# EAGLE schematic board (EAGLE 9.5.2)
CNAME: ATMEGA328P Dev Board; CREVISION: 0.1.0

## Sheet 1 of 3
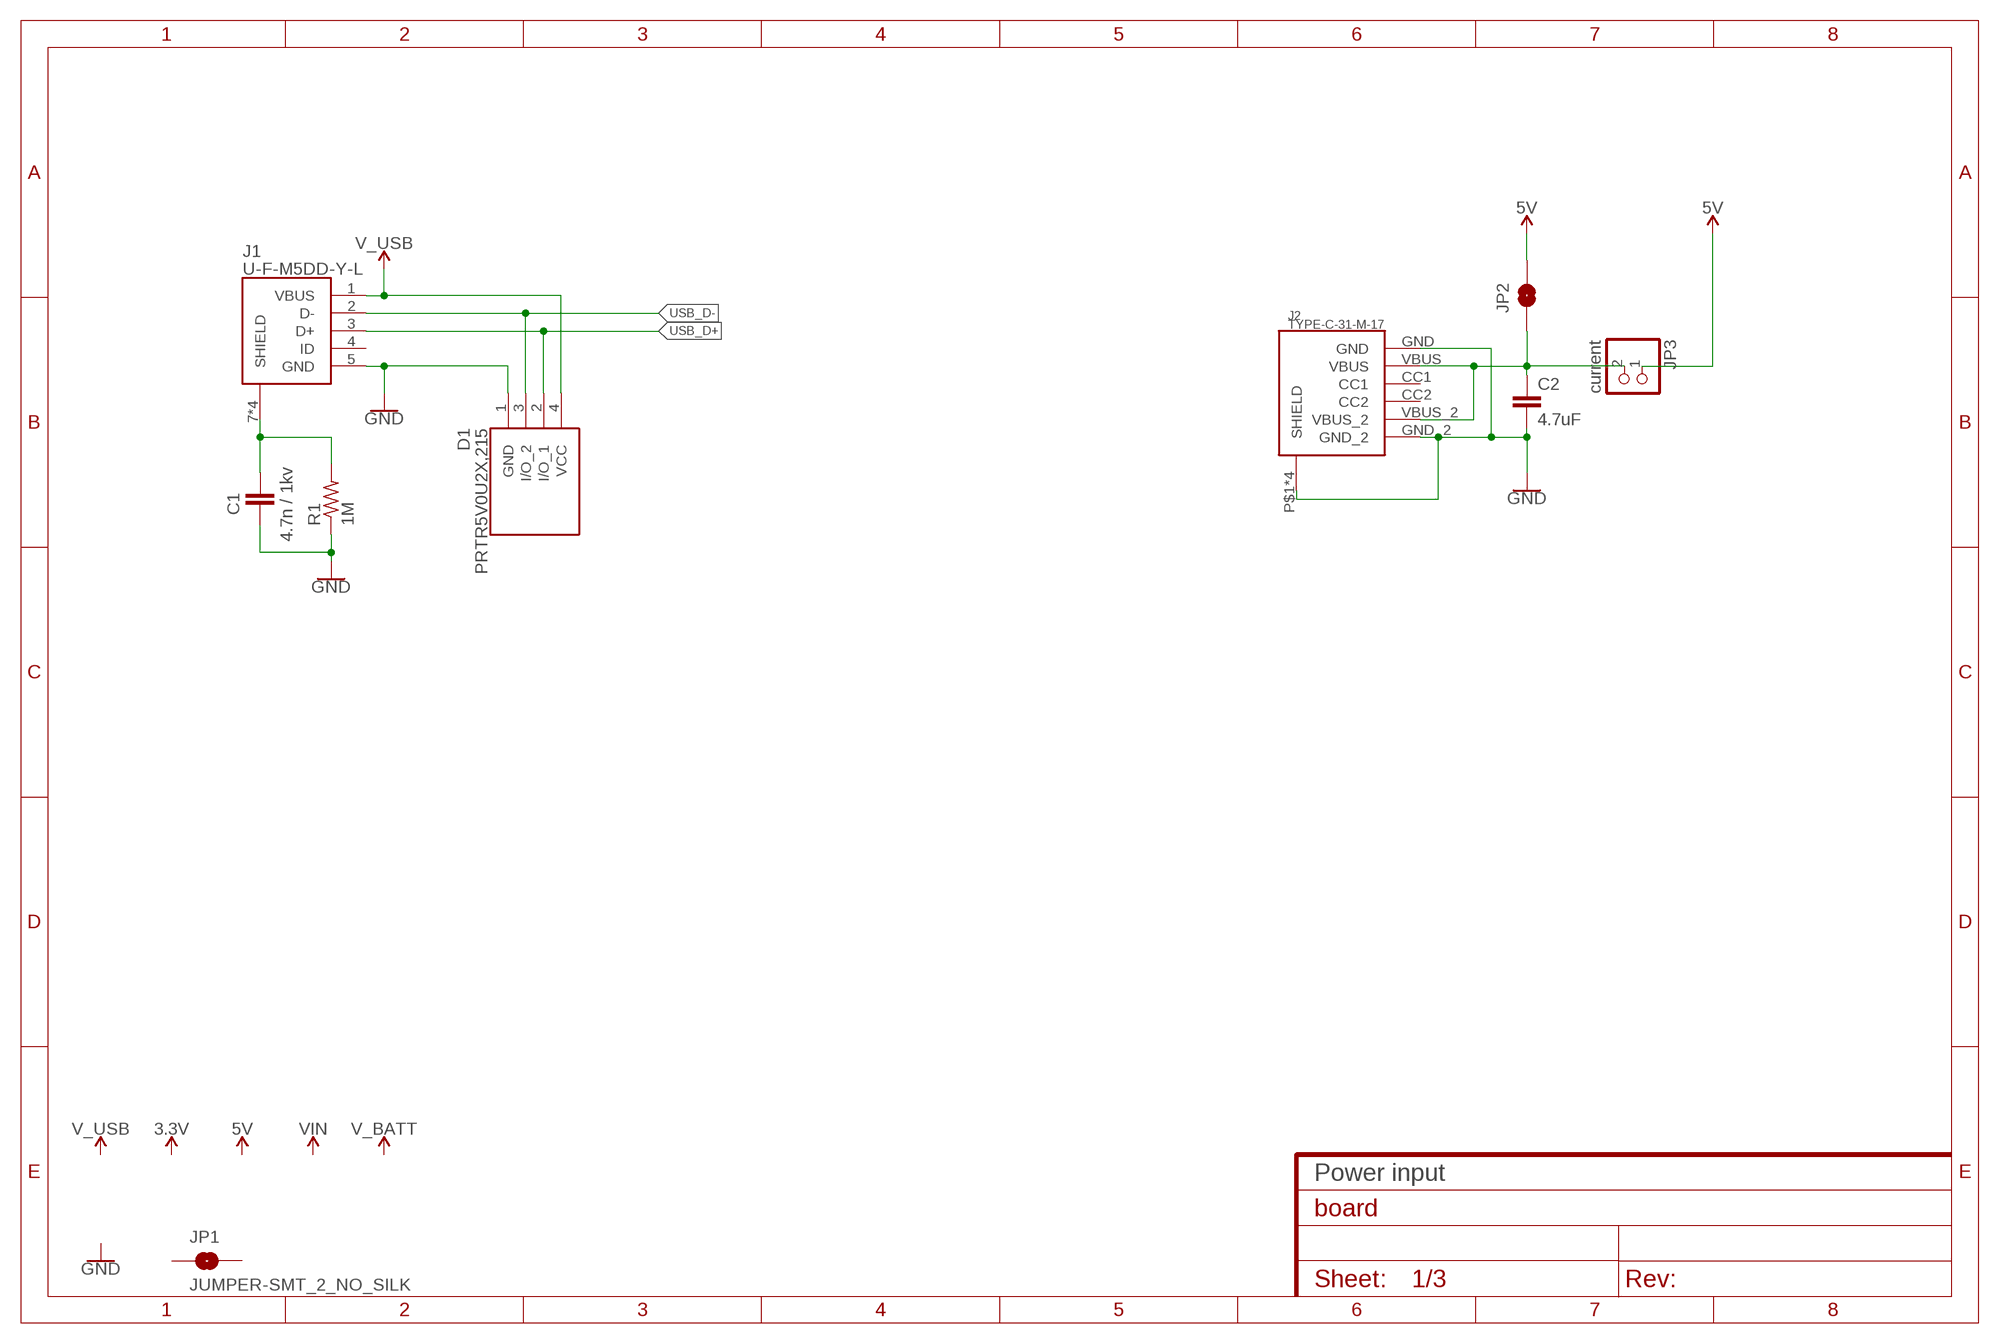
[diagram p0: schematic, sheet 1]

### Parts
C1  4.7n / 1kv  C-EUC0603  [C0603]
C2  4.7uF  C-EUC0603  [C0603]
D1  PRTR5V0U2X,215  [SOT-143B]
J1  U-F-M5DD-Y-L  [UFM5DDYL]
J2  TYPE-C-31-M-17  [TYPE-C-31-M-17]
JP1  JUMPER-SMT_2_NO_SILK  [SMT-JUMPER_2_NO_SILK]
JP2  JUMPER-SMT_2_NO_NO-SILK  [SMT-JUMPER_2_NO_NO-SILK]
JP3  current  PINHD-1X2/OCT  [1X02/OCT]
R1  1M  R-US_R0603  [R0603]

### Nets
5V [power]: JP2.2 JP3.1 ; also sheet 2
GND [power]: C1.2 C2.2 D1.1(GND) J1.5(GND) J2.GND J2.GND_2 J2.P$1(SHIELD) J2.P$2(SHIELD) J2.P$3(SHIELD) J2.P$4(SHIELD) R1.1 ; also sheet 2
N$1: C1.1 J1.7(SHIELD) J1.8(SHIELD) J1.9(SHIELD) J1.10(SHIELD) R1.2
N$13 [power]: C2.1 J2.VBUS J2.VBUS_2 JP2.1 JP3.2
USB_D+: D1.2(I/O_1) J1.3(D+)
USB_D-: D1.3(I/O_2) J1.2(D-)
V_USB [power]: D1.4(VCC) J1.1(VBUS)
Unconnected: J1.4(ID) J2.CC1 J2.CC2 JP1.1 JP1.2

### Notes on the sheet
- Power input

## Sheet 2 of 3
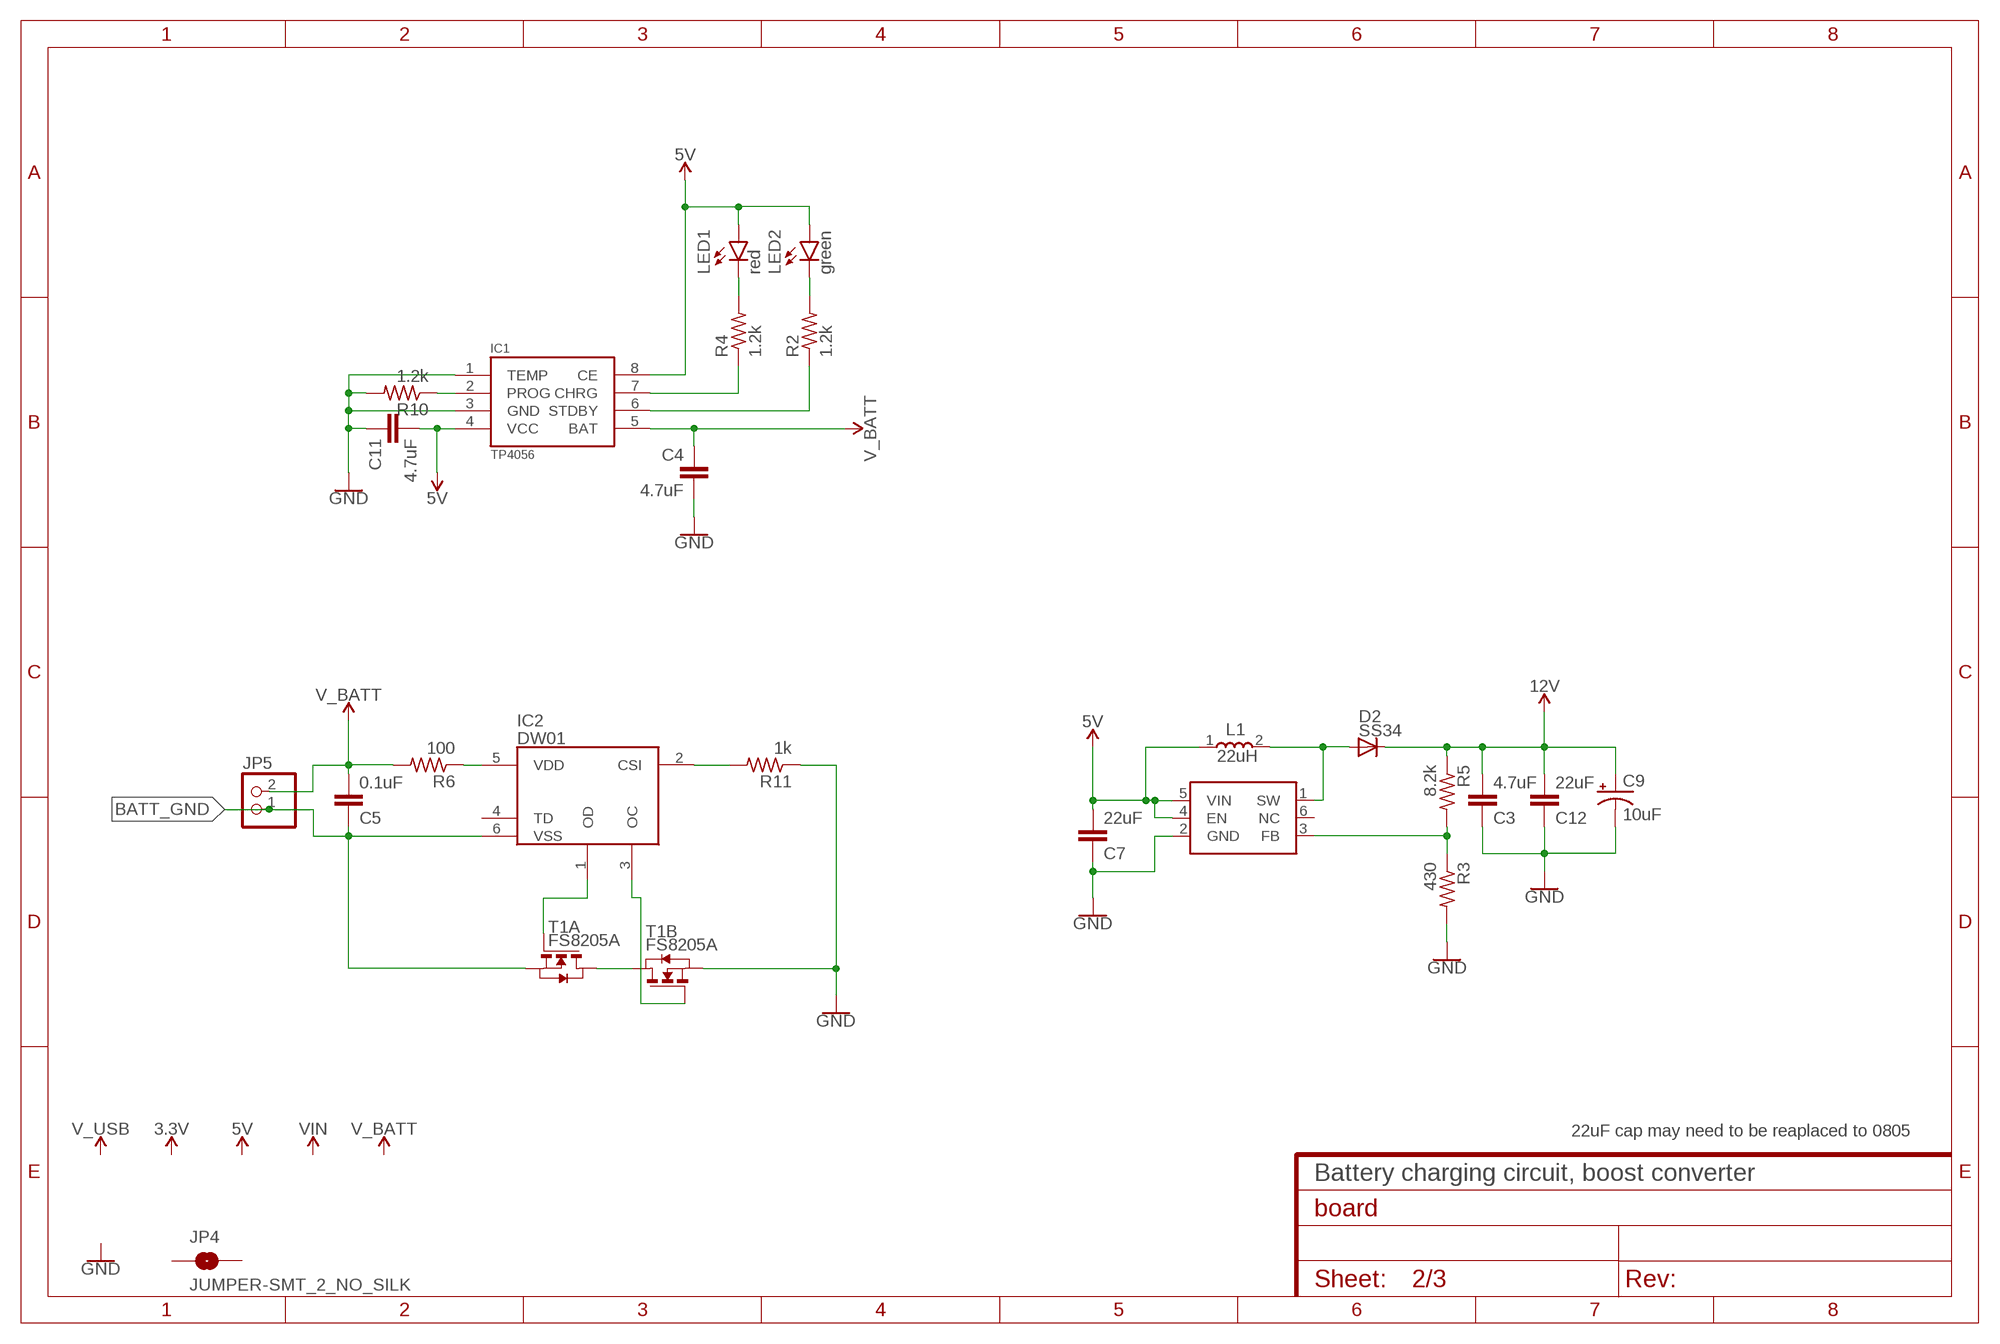
[diagram p1: schematic, sheet 2]

### Parts
C3  4.7uF  C-EUC0603  [C0603]
C4  4.7uF  C-EUC0603  [C0603]
C5  0.1uF  C-EUC0603  [C0603]
C7  22uF  C-EUC0603  [C0603]
C9  10uF  CPOL-USSMCA  [SMC_A]
C11  4.7uF  C-EUC0603  [C0603]
C12  22uF  C-EUC0603  [C0603]
D2  SS34  DIODE-DO214AC  [DO214AC]
IC1  TP4056  [SOP-8]
IC2  DW01  [SOT95P280X135-6N]
JP4  JUMPER-SMT_2_NO_SILK  [SMT-JUMPER_2_NO_SILK]
JP5  PINHD-1X2/OCT  [1X02/OCT]
L1  22uH  BCIHP0730-220M  [INDPM7066X300N]
LED1  red  LEDCHIP-LED0805  [CHIP-LED0805]
LED2  green  LEDCHIP-LED0805  [CHIP-LED0805]
R2  1.2k  R-US_R0603  [R0603]
R3  430  R-US_R0603  [R0603]
R4  1.2k  R-US_R0603  [R0603]
R5  8.2k  R-US_R0603  [R0603]
R6  100  R-US_R0603  [R0603]
R10  1.2k  R-US_R0603  [R0603]
R11  1k  R-US_R0603  [R0603]
T1  FS8205A  FS8205A-MOSFET  [TSSOP-8]
U1  MT3608  [SOT23-6]

### Nets
5V [power]: C7.1 C11.1 IC1.4(VCC) IC1.8(CE) L1.1 LED1.A LED2.A U1.4(EN) U1.5(VIN) ; also sheet 1
12V [power]: C3.1 C9.+ C12.1 D2.C R5.1
BATT_GND [power]: C5.2 IC2.6(VSS) JP5.1 T1.2(A:S) T1.3(A:S)
GND [power]: C3.2 C4.1 C7.2 C9.- C11.2 C12.2 IC1.1(TEMP) IC1.3(GND) R3.2 R10.2 R11.1 T1.6(B:S) T1.7(B:S) U1.2(GND) ; also sheet 1
N$2: IC1.7(CHRG) R4.1
N$3: IC1.6(STDBY) R2.1
N$4 [power]: IC2.5(VDD) R6.1
N$5: IC2.2(CSI) R11.2
N$6 [power]: T1.1(A:D) T1.8(B:D)
N$7: IC2.1(OD) T1.4(A:G)
N$8: IC1.2(PROG) R10.1
N$9: LED2.C R2.2
N$10: IC2.3(OC) T1.5(B:G)
N$11: LED1.C R4.2
N$12 [power]: D2.A L1.2 U1.1(SW)
N$14: R3.1 R5.2 U1.3(FB)
V_BATT [power]: C4.2 C5.1 IC1.5(BAT) JP5.2 R6.2
Unconnected: IC2.4(TD) JP4.1 JP4.2 U1.6(NC)

### Notes on the sheet
- 22uF cap may need to be reaplaced to 0805
- Battery charging circuit, boost converter

## Sheet 3 of 3
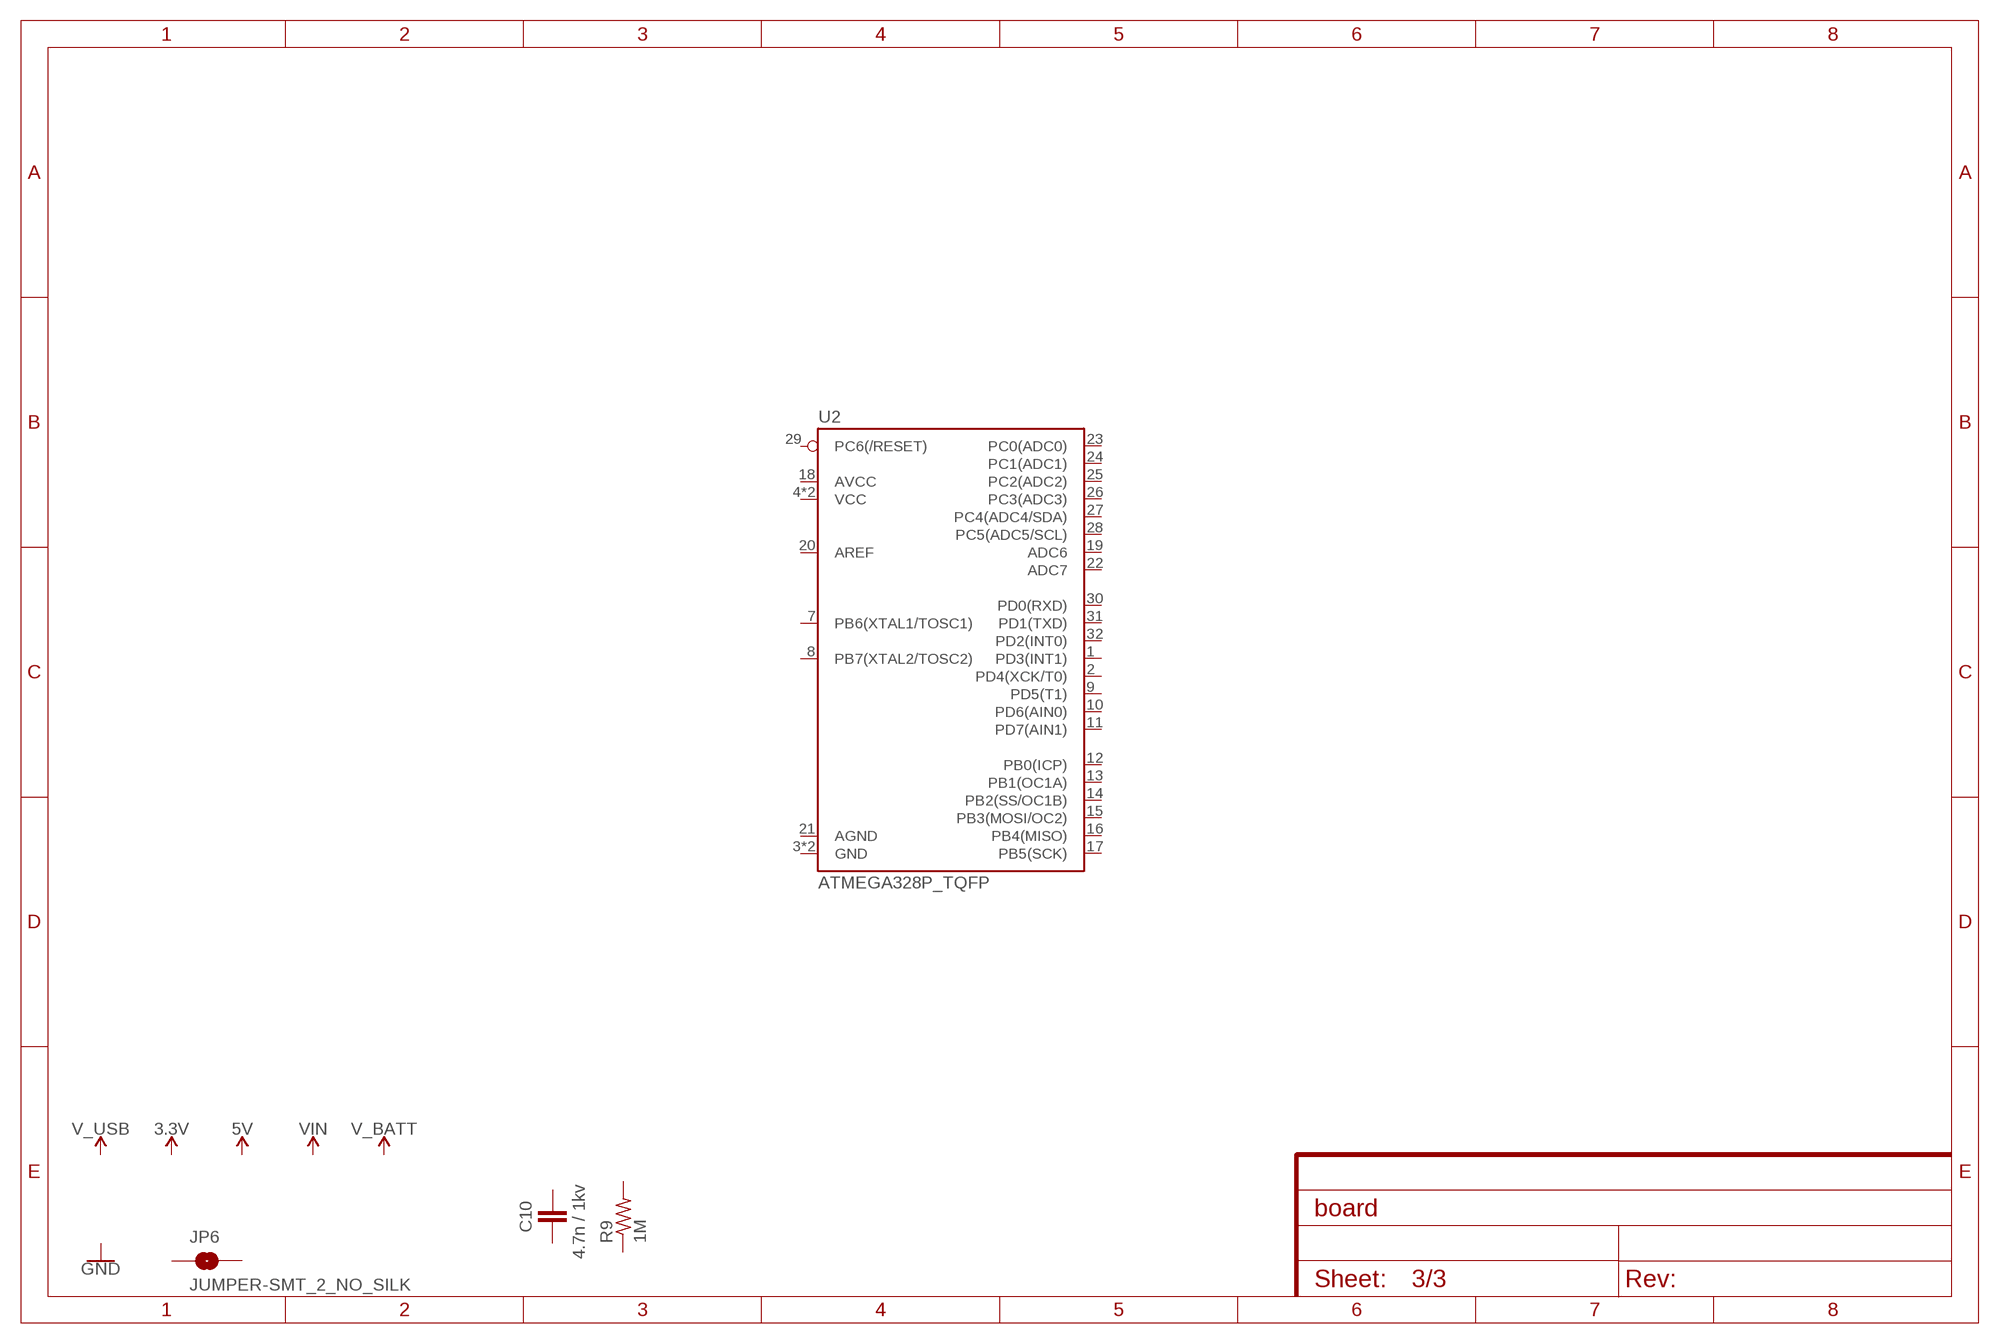
[diagram p2: schematic, sheet 3]

### Parts
C10  4.7n / 1kv  C-EUC0603  [C0603]
JP6  JUMPER-SMT_2_NO_SILK  [SMT-JUMPER_2_NO_SILK]
R9  1M  R-US_R0603  [R0603]
U2  ATMEGA328P_TQFP  [TQFP32-08]
Unconnected: C10.1 C10.2 JP6.1 JP6.2 R9.1 R9.2 U2.1(PD3(INT1)) U2.2(PD4(XCK/T0)) U2.3(GND) U2.4(VCC) U2.5(GND) U2.6(VCC) U2.7(PB6(XTAL1/TOSC1)) U2.8(PB7(XTAL2/TOSC2)) U2.9(PD5(T1)) U2.10(PD6(AIN0)) U2.11(PD7(AIN1)) U2.12(PB0(ICP)) U2.13(PB1(OC1A)) U2.14(PB2(SS/OC1B)) U2.15(PB3(MOSI/OC2)) U2.16(PB4(MISO)) U2.17(PB5(SCK)) U2.18(AVCC) U2.19(ADC6) U2.20(AREF) U2.21(AGND) U2.22(ADC7) U2.23(PC0(ADC0)) U2.24(PC1(ADC1)) U2.25(PC2(ADC2)) U2.26(PC3(ADC3)) U2.27(PC4(ADC4/SDA)) U2.28(PC5(ADC5/SCL)) U2.29(PC6(/RESET)) U2.30(PD0(RXD)) U2.31(PD1(TXD)) U2.32(PD2(INT0))

## Library data of the parts
C1-C5 C7 C10-C12 = rcl:C-EU: CAPACITOR, European symbol; SPICEPREFIX: C
C9 = rcl:CPOL-US: POLARIZED CAPACITOR, American symbol; SPICEPREFIX: C
D1 = SamacSys_Parts:PRTR5V0U2X,215: ESD Protection Diodes 5.5V Dual SOT143B NXP PRTR5V0U2X,215 Dual Uni-Directional TVS Diode, 4-Pin SOT-143B Source: Datasheet <https://datasheet.lcsc.com/szlcsc/Nexperia-PRTR5V0U2X-215_C12333.pdf>; DESCRIPTION: ESD Protection Diodes 5.5V Dual SOT143B NXP PRTR5V0U2X,215 Dual Uni-Directional TVS Diode, 4-Pin SOT-143B; HEIGHT: mm; LCSC_PART_NUMBER: C12333; LCSC_PRICE-STOCK: https://lcsc.com/product-detail/Diodes-ESD_Nexperia_PRTR5V0U2X-215_PRTR5V0U2X-215_C12333.html; MANUFACTURER_NAME: Nexperia; MANUFACTURER_PART_NUMBER: PRTR5V0U2X,215
D2 = diode:DIODE-: DIODE
IC1 = TP4056:TP4056
IC2 = DW01:DW01: ic Source: Datasheet <https://datasheet.lcsc.com/szlcsc/1906271838_SLKORMICRO-Elec-DW01_C359989.pdf>; DESCRIPTION: ic; HEIGHT: 1.35mm; MANUFACTURER_NAME: Slkor; MANUFACTURER_PART_NUMBER: DW01
J1 = SamacSys_Parts:U-F-M5DD-Y-L: USB Connector Source: Datasheet <https://datasheet.lcsc.com/szlcsc/1903211730_Korean-Hroparts-Elec-U-F-M5DD-Y-L_C91146.pdf>; DESCRIPTION: USB Connector; HEIGHT: 3.4mm; LCSC_PART_NUMBER: C91146; LCSC_PRICE-STOCK: https://lcsc.com/product-detail/Micro-USB-Connectors_Korean-Hroparts-Elec-U-F-M5DD-Y-L_C91146.html; MANUFACTURER_NAME: Korean Hroparts Elec; MANUFACTURER_PART_NUMBER: U-F-M5DD-Y-L
J2 = Type-C_Hroparts:TYPE-C-31-M-17
JP1 JP2 JP4 JP6 = SparkFun-Jumpers:JUMPER-SMT_2_NO: Normally open jumper This jumper has two pads in close proximity to each other. Apply solder to close the connection. Round pads are easier to solder for beginners, but are a lot larger. SparkFun Product that uses the round pads: SparkFun EL Sequencer <https://www.sparkfun.com/products/12781>
JP3 JP5 = pinhead_v2:PINHD-1X2: PIN HEADER
L1 = BCIHP0730-220M:BCIHP0730-220M: Inductors (SMD) SMD,7x7x3mm RoHS Source: Datasheet <https://datasheet.lcsc.com/szlcsc/Bao-Cheng-Elec-BC-BCIHP0730-220M_C237916.pdf>; DESCRIPTION: Inductors (SMD) SMD,7x7x3mm RoHS; HEIGHT: 3mm; MANUFACTURER_NAME: Bao Cheng Elec; MANUFACTURER_PART_NUMBER: BCIHP0730-220M
LED1 LED2 = led:LED: LED OSRAM: - CHIPLED LG R971, LG N971, LY N971, LG Q971, LY Q971, LO R971, LY R971 LH N974, LH R974 LS Q976, LO Q976, LY Q976 LO Q996 - Hyper CHIPLED LW Q18S LB Q993, LB Q99A, LB R99A - SideLED LS A670, LO A670, LY A670, LG A670, LP A670 LB A673, LV A673, LT A673, LW A673 LH A674 LY A675 LS A676, LA A676, LO A676, LY A676, LW A676 LS A679, LY A679, LG A679 - Hyper Micro SIDELED® LS Y876, LA Y876, LO Y876, LY Y876 LT Y87S - SmartLED LW L88C, LW L88S LB L89C, LB L89S, LG L890 LS L89K, LO L89K, LY L89K LS L896, LA L896, LO L896, LY L896 - TOPLED LS T670, LO T670, LY T670, LG T670, LP T670 LSG T670, LSP T670, LSY T670, LOP T670, LYG T670 LG T671, LOG T671, LSG T671 LB T673, LV T673, LT T673, LW T673 LH T674 LS T676, LA T676, LO T676, LY T676, LB T676, LH T676, LSB T676, LW T676 LB T67C, LV T67C, LT T67C, LS T67K, LO T67K, LY T67K, LW E67C LS E67B, LA E67B, LO E67B, LY E67B, LB E67C, LV E67C, LT E67C LW T67C LS T679, LY T679, LG T679 LS T770, LO T770, LY T770, LG T770, LP T770 LB T773, LV T773, LT T773, LW T773 LH T774 LS E675, LA E675, LY E675, LS T675 LS T776, LA T776, LO T776, LY T776, LB T776 LHGB T686 LT T68C, LB T68C - Hyper Mini TOPLED® LB M676 - Mini TOPLED Santana® LG M470 LS M47K, LO M47K, LY M47K Source: http://www.osram.convergy.de LUXEON: - LUMILED® LXK2-PW12-R00, LXK2-PW12-S00, LXK2-PW14-U00, LXK2-PW14-V00 LXK2-PM12-R00, LXK2-PM12-S00, LXK2-PM14-U00 LXK2-PE12-Q00, LXK2-PE12-R00, LXK2-PE12-S00, LXK2-PE14-T00, LXK2-PE14-U00 LXK2-PB12-K00, LXK2-PB12-L00, LXK2-PB12-M00, LXK2-PB14-N00, LXK2-PB14-P00, LXK2-PB14-Q00 LXK2-PR12-L00, LXK2-PR12-M00, LXK2-PR14-Q00, LXK2-PR14-R00 LXK2-PD12-Q00, LXK2-PD12-R00, LXK2-PD12-S00 LXK2-PH12-R00, LXK2-PH12-S00 LXK2-PL12-P00, LXK2-PL12-Q00, LXK2-PL12-R00 Source: www.luxeon.com KINGBRIGHT: KA-3528ASYC Source: www.kingbright.com
R1-R6 R9-R11 = rcl:R-US_: RESISTOR, American symbol; SPICEPREFIX: R
T1 = FS8205A:FS8205A-MOSFET: DUAL N-CHANNEL ENHANCEMENT MODE MOSFET data sheet <http://goo.gl/dRgboR> Dave.Calaway Eagle Library <https://goo.gl/Muy1Tr>
U1 = buckboost:MT3608
U2 = SparkFun-IC-Microcontroller:ATMEGA328P_TQFP: Popular 328P in QFP Storefront component: ATmega328 - TQFP <https://www.sparkfun.com/products/13448> (COM-13448) Datasheet <http://www.sparkfun.com/datasheets/Components/SMD/ATMega328.pdf> SparkFun Products SparkFun RedBoard - Programmed with Arduino <https://www.sparkfun.com/products/12757> (DEV-12757) Arduino Pro Mini 328 - 5V/16MHz <https://www.sparkfun.com/products/11113> (DEV-11113) Arduino Pro Mini 328 - 3.3V/8MHz <https://www.sparkfun.com/products/11114> (DEV-11114) SparkFun OpenLog <https://www.sparkfun.com/products/13712> (DEV-13712) SparkFun MicroView - OLED Arduino Module <https://www.sparkfun.com/products/12923> (DEV-12923) SparkFun Digital Sandbox <https://www.sparkfun.com/products/12651> (DEV-12651) SparkFun PicoBoard <https://www.sparkfun.com/products/11888> (WIG-11888) Arduino Fio <https://www.sparkfun.com/products/10116> (DEV-10116) LilyPad Arduino 328 Main Board <https://www.sparkfun.com/products/13342> (DEV-13342) SparkFun RedStick <https://www.sparkfun.com/products/13741> (DEV-13741) LilyPad MP3 <https://www.sparkfun.com/products/11013> (DEV-11013) LilyPad Arduino SimpleSnap <https://www.sparkfun.com/products/10941> (DEV-10941) SparkFun Stepoko <https://www.sparkfun.com/products/13899> (ROB-13899) SparkFun Geiger Counter <https://www.sparkfun.com/products/11345> (SEN-11345) SparkFun EL Sequencer <https://www.sparkfun.com/products/12781> (COM-12781) Arduino Pro 328 - 5V/16MHz <https://www.sparkfun.com/products/10915> (DEV-10915) CryptoCape <https://www.sparkfun.com/products/12773> (DEV-12773) SparkFun IR Thermometer Evaluation Board - MLX90614 <https://www.sparkfun.com/products/10740> (SEN-10740) SparkFun RedBot Mainboard <https://www.sparkfun.com/products/12097> (ROB-12097) Arduino Pro 328 - 3.3V/8MHz <https://www.sparkfun.com/products/10914> (DEV-10914) SparkFun Block for Intel® Edison - Arduino <https://www.sparkfun.com/products/13036> (DEV-13036) SparkFun Simon Says - Surface Mount Soldering Kit <https://www.sparkfun.com/products/10935> (KIT-10935) SparkFun 7-Segment Serial Display - Red <https://www.sparkfun.com/products/11441> (COM-11441) SparkFun 7-Segment Serial Display - White <https://www.sparkfun.com/products/11629> (COM-11629) SparkFun 7-Segment Serial Display - Yellow <https://www.sparkfun.com/products/11443> (COM-11443) SparkFun 7-Segment Serial Display - Kelly Green <https://www.sparkfun.com/products/11440> (COM-11440) SparkFun 7-Segment Serial Display - Blue <https://www.sparkfun.com/products/11442> (COM-11442) SparkFun OpenSegment Serial Display - 20mm (Blue) <https://www.sparkfun.com/products/11647> (COM-11647) SparkFun OpenSegment Serial Display - 20mm (Green) <https://www.sparkfun.com/products/11646> (COM-11646) SparkFun OpenSegment Serial Display - 20mm (White) <https://www.sparkfun.com/products/11648> (COM-11648) SparkFun OpenSegment Serial Display - 20mm (Red) <https://www.sparkfun.com/products/11644> (COM-11644) SparkFun OpenSegment Serial Display - 20mm (Yellow) <https://www.sparkfun.com/products/11645> (COM-11645) SparkFun OpenSegment Shield <https://www.sparkfun.com/products/13190> (DEV-13190); PROD_ID: IC-09069

## Net classes
0 default: width 0.203 mm
1 power: width 0.508 mm